# EAGLE design CONTROL circuit for Junction Box v2 (EAGLE 9.6.2)
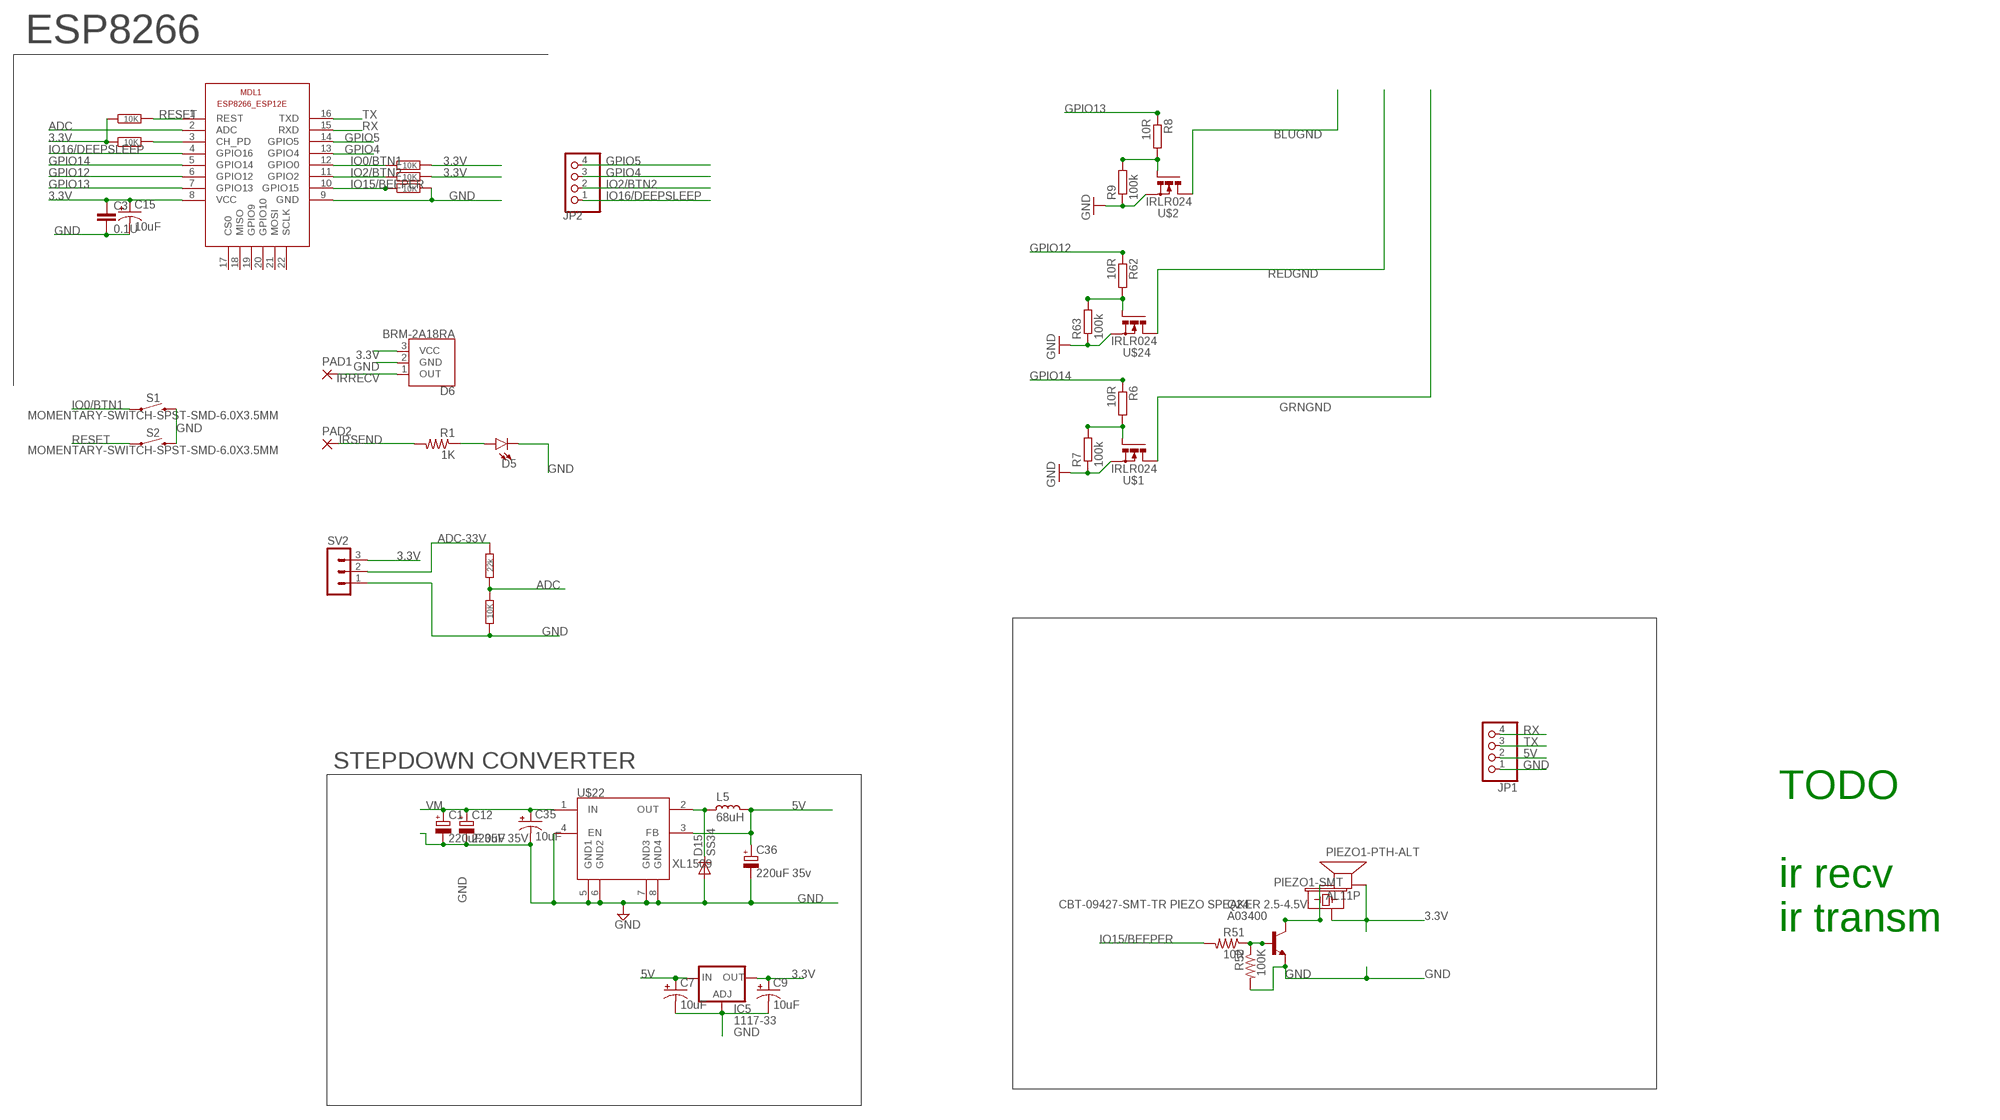
[diagram p0: schematic, sheet 1]

## Parts
C1  220uF 35V  CPOL-EUE3.5-8  [E3,5-8]
C3  0.1U  C-EUC1206  [C1206]
C7  10uF  CAP_POL1206  [EIA3216]
C9  10uF  CAP_POL1206  [EIA3216]
C12  220uF 35V  CPOL-EUE3.5-8  [E3,5-8]
C15  10uF  CAP_POL1206  [EIA3216]
C35  10uF  CAP_POL1206  [EIA3216]
C36  220uF 35v  CPOL-EUE3.5-8  [E3,5-8]
D5  LED3MM  [LED_3MM]
D6  BRM-2A18RA  [BRM-2508]
D15  SS34  DIODE-DO-214AC  [DO-214AC]
IC5  1117-33  LD117AS33TR  [SOT223]
JP1  PINHD-1X4  [1X04]
JP2  PINHD-1X4  [1X04]
L5  68uH  L_CD75  [CD75]
MDL1  ESP8266-12EESP8266-ESP12E  [ESP8266-ESP12E]
PAD1  1,6/0,9  [1,6/0,9]
PAD2  1,6/0,9  [1,6/0,9]
PIEZO1-PTH-ALT  AL11P  SPEAKER/AL11P  [AL11P]
PIEZO1-SMT  CBT-09427-SMT-TR PIEZO SPEAKER 2.5-4.5V  BUZZER-SMD  [BUZZER-CCV]
Q24  A03400  BC849SMD  [SOT23-BEC]
R1  1K  R-US_M1206  [M1206]
R3  22k  R-EU_R1206  [R1206]
R4  10K  R-EU_R1206  [R1206]
R6  10R  R-EU_R1206  [R1206]
R7  100k  R-EU_R1206  [R1206]
R8  10R  R-EU_R1206  [R1206]
R9  100k  R-EU_R1206  [R1206]
R11  10K  R-EU_R1206  [R1206]
R12  10K  R-EU_R1206  [R1206]
R28  10K  R-EU_R1206  [R1206]
R29  10K  R-EU_R1206  [R1206]
R31  10K  R-EU_R1206  [R1206]
R51  10R  R-US_R1206  [R1206]
R52  100K  R-US_R1206  [R1206]
R62  10R  R-EU_R1206  [R1206]
R63  100k  R-EU_R1206  [R1206]
S1  MOMENTARY-SWITCH-SPST-SMD-6.0X3.5MM  [TACTILE_SWITCH_SMD_6.0X3.5MM]
S2  MOMENTARY-SWITCH-SPST-SMD-6.0X3.5MM  [TACTILE_SWITCH_SMD_6.0X3.5MM]
SV2  MA03-1  [MA03-1]
U$1  IRLR024  N-POWER-MOSFETDPAK-MOSFET  [D-PAK_TO252AA]
U$2  IRLR024  N-POWER-MOSFETDPAK-MOSFET  [D-PAK_TO252AA]
U$22  XL1509  [SO08]
U$24  IRLR024  N-POWER-MOSFETDPAK-MOSFET  [D-PAK_TO252AA]

## Nets
3.3V: C3.1 C9.A(+) C15.A(+) D6.3(VCC) IC5.4(OUT) MDL1.8(VCC) PIEZO1-PTH-ALT.- PIEZO1-SMT.+ R11.2 R12.2 R28.1 R29.1 SV2.3
5V: C7.A(+) C36.+ IC5.3(IN) JP1.2 L5.1 U$22.3(FB)
ADC: MDL1.2(ADC) R3.1 R4.2
ADC-33V: R3.2 SV2.2
BEEPER-GND: PIEZO1-PTH-ALT.+ PIEZO1-SMT.- Q24.C
BLUGND: U$2.4(D)
GND: C1.- C3.2 C7.C(-) C9.C(-) C12.- C15.C(-) C35.C(-) C36.- D5.K(C) D6.2(GND) D15.2(A) IC5.1(ADJ) JP1.1 MDL1.9(GND) Q24.E R4.1 R7.1 R9.1 R31.2 R52.2 R63.1 S1.2 S2.2 SV2.1 U$1.3(S) U$2.3(S) U$22.4(EN) U$22.5(GND1) U$22.6(GND2) U$22.7(GND3) U$22.8(GND4) U$24.3(S)
GPIO4: JP2.3 MDL1.13(GPIO4)
GPIO5: JP2.4 MDL1.14(GPIO5)
GPIO12: MDL1.6(GPIO12) R62.1
GPIO13: MDL1.7(GPIO13) R8.1
GPIO14: MDL1.5(GPIO14) R6.1
GRNGND: U$1.4(D)
IO0/BTN1: MDL1.12(GPIO0) R12.1 S1.1
IO2/BTN2: JP2.2 MDL1.11(GPIO2) R11.1
IO15/BEEPER: MDL1.10(GPIO15) R31.1 R51.2
IO16/DEEPSLEEP: JP2.1 MDL1.4(GPIO16)
IRRECV: D6.1(OUT) PAD1.1(P)
IRSEND: PAD2.1(P) R1.2
N$3: R62.2 R63.2 U$24.1(G)
N$4: D15.1(C) L5.2 U$22.2(OUT)
N$5: R6.2 R7.2 U$1.1(G)
N$7: R8.2 R9.2 U$2.1(G)
N$13: D5.A R1.1
N$18: MDL1.3(CH_PD) R28.2
N$66: Q24.B R51.1 R52.1
REDGND: U$24.4(D)
RESET: MDL1.1(REST) R29.2 S2.1
RX: JP1.4 MDL1.15(RXD)
TX: JP1.3 MDL1.16(TXD)
VM: C1.+ C12.+ C35.A(+) U$22.1(IN)
Unconnected: MDL1.17(CS0) MDL1.18(MISO) MDL1.19(GPIO9) MDL1.20(GPIO10) MDL1.21(MOSI) MDL1.22(SCLK)

## Notes on the sheet
- ESP8266
- STEPDOWN CONVERTER
- TODO
  
  ir recv
  ir transm

## Library data of the parts
C1 C12 C36 = rcl:CPOL-EU: POLARIZED CAPACITOR, European symbol
C3 = rcl:C-EU: CAPACITOR, European symbol
C7 C9 C15 C35 = SparkFun:CAP_POL: Capacitor Polarized These are standard SMD and PTH capacitors. Normally 10uF, 47uF, and 100uF in electrolytic and tantalum varieties. Always verify the external diameter of the through hole cap, it varies with capacity, voltage, and manufacturer. The EIA devices should be standard.
D5 = SparkFun-LED:LED: LED (Generic) Standard schematic elements and footprints for 5mm, 3mm, 1206, and 0603 sized LEDs. Generic LEDs with no color specified.; PROD_ID: DIO-08794
D6 = SparkFun-Sensors:BRM-2A18: BRM-2A18 IR Receiver The BRM-2A18 is miniaturized infrared receiver for remote control and other applications requiring improved ambient light rejection. Vertical package is a primary component on the ZX Distance and Gesture Sensor. RA package is not currently in-use. Example Datasheet <http://www.sinoskysun.com/upload/20110512/201105120447164615.PDF> SparkFun Products ZX Distance and Gesture Sensor <https://www.sparkfun.com/products/12780> (COM-12780)
D15 = dp_devices:DIODE: Various Diode Packages
IC5 = v-reg:LD117A?*: Low drop fixed and adjustable positive voltage regulators 1 A Source: http://www.st.com/stonline/products/literature/ds/7194/ld1117axx.pdf
JP1 JP2 = pinhead:PINHD-1X4: PIN HEADER
L5 = rc-master-smd:L_: INDUCTOR
MDL1 = ESP8266-ESP12E:ESP8266-12E: ESP8266-12E with additional I/O and GPIO04/05 corrected The author cannot warrant that this library is free from error or will meet your specific requirements. Created by PuceBaboon.com. Komagane, Nagano, JAPAN
PAD1 PAD2 = wirepad:1,6/0,9: THROUGH-HOLE PAD
PIEZO1-PTH-ALT = adafruit:SPEAKER: SPEAKER Source: Buerklin Added PS12 (for part # PS1240 piezo) http://www.ladyada.net/library/pcb/eaglelibrary.html
PIEZO1-SMT = SparkFun-Electromechanical:BUZZER: Buzzer Small round buzzers that operate around the audible 2kHz range. You can use these as speakers to create simple music or user interfaces. Variant Overview: PTH - Mini Speaker - PC Mount 12mm 2.048kHz <https://www.sparkfun.com/products/7950> PTH_KIT - Mini Speaker - PC Mount 12mm 2.048kHz <https://www.sparkfun.com/products/7950> KIT simplifies soldering by adding stop mask to one side of the pads. PTH_NO_SILK - Mini Speaker - PC Mount 12mm 2.048kHz <https://www.sparkfun.com/products/7950> No silkscreen indicator of buzzer outline. PTH_KIT_NO_SILK - Mini Speaker - PC Mount 12mm 2.048kHz <https://www.sparkfun.com/products/7950> KIT package w/o silkscreen SMD - Buzzer Audio Magnetic (CCV-084B16) SMD buzzer used on, e.g. the LilyPad Buzzer <https://www.sparkfun.com/products/8463> and RFID USB Reader <https://www.sparkfun.com/products/9963>. SMD_KIT - Buzzer Audio Magnetic (CCV-084B16) SMD Buzzer with elongated pins to make soldering easier. Used on the SparkFun Simon Says - Surface Mount Soldering Kit <https://www.sparkfun.com/products/10935>.; PROD_ID: COMP-08568
Q24 = transistor-npn:BC849*: NPN Transistor
R1 R51 R52 = adafruit:R-US_: RESISTOR, American symbol
R3 R4 R11 R12 R28 R29 R31 = rcl:R-EU_: RESISTOR, European symbol
R6-R9 R62 R63 = resistor:R-EU_: RESISTOR, European symbol
S1 S2 = SparkFun-Switches:MOMENTARY-SWITCH-SPST: Momentary Switch (Pushbutton) - SPST Normally-open (NO) SPST momentary switches (buttons, pushbuttons). Variants PTH-12MM - 12mm square, through-hole Momentary Pushbutton Switch - 12mm Square <https://www.sparkfun.com/products/9190> (COM-09190) PTH-6.0MM, PTH-6.0MM-KIT - 6.0mm square, through-hole Mini Pushbutton Switch <https://www.sparkfun.com/products/97> (COM-00097) KIT package intended for soldering kit's - only one side of pads' copper is exposed. PTH-RIGHT-ANGLE-KIT - Right-angle, through-hole Right Angle Tactile Button <https://www.sparkfun.com/products/10791> - Used on SparkFun BigTime Watch Kit <https://www.sparkfun.com/products/11734> SMD-12MM - 12mm square, surface-mount Tactile Button - SMD (12mm) <https://www.sparkfun.com/products/12993> (COM-12993) Used on SparkFun PicoBoard <https://www.sparkfun.com/products/11888> SMD-4.5MM - 4.5mm Square Trackball Switch Used on SparkFun Blackberry Trackballer Breakout <https://www.sparkfun.com/products/13169> SMD-4.6MMX2.8MM - 4.60mm x 2.80mm, surface mount Used on SparkFun SAMD21 Mini Breakout <https://www.sparkfun.com/products/13664> SMD-5.2MM, SMD-5.2-REDUNDANT - 5.2mm square, surface-mount Mini Pushbutton Switch - SMD <https://www.sparkfun.com/products/8720> (COM-08720) Used on Arduino Pro Mini <https://www.sparkfun.com/products/11114> REDUNDANT package connects both switch circuits together SMD-6.0X3.5MM - 6.0 x 3.5mm, surface mount Momentary Reset Switch SMD <https://www.sparkfun.com/products/8229> (COM-08229) SMD-6.2MM-TALL - 6.2mm square, surface mount Tactile Button - SMD (6mm) <https://www.sparkfun.com/products/12992> Used on SparkFun Digital Sandbox <https://www.sparkfun.com/products/12651> SMD-RIGHT-ANGLE - Right-angle, surface mount Used on SparkFun Block for Intel® Edison - Arduino <https://www.sparkfun.com/products/13036>; PROD_ID: SWCH-00815; SF_SKU: COM-08229
SV2 = con-lstb:MA03-1: PIN HEADER; OC_FARNELL: unknown; OC_NEWARK: unknown
U$1 U$2 U$24 = Cohesion_parts:N-POWER-MOSFET
U$22 = Cohesion_parts:XL1509

## Board
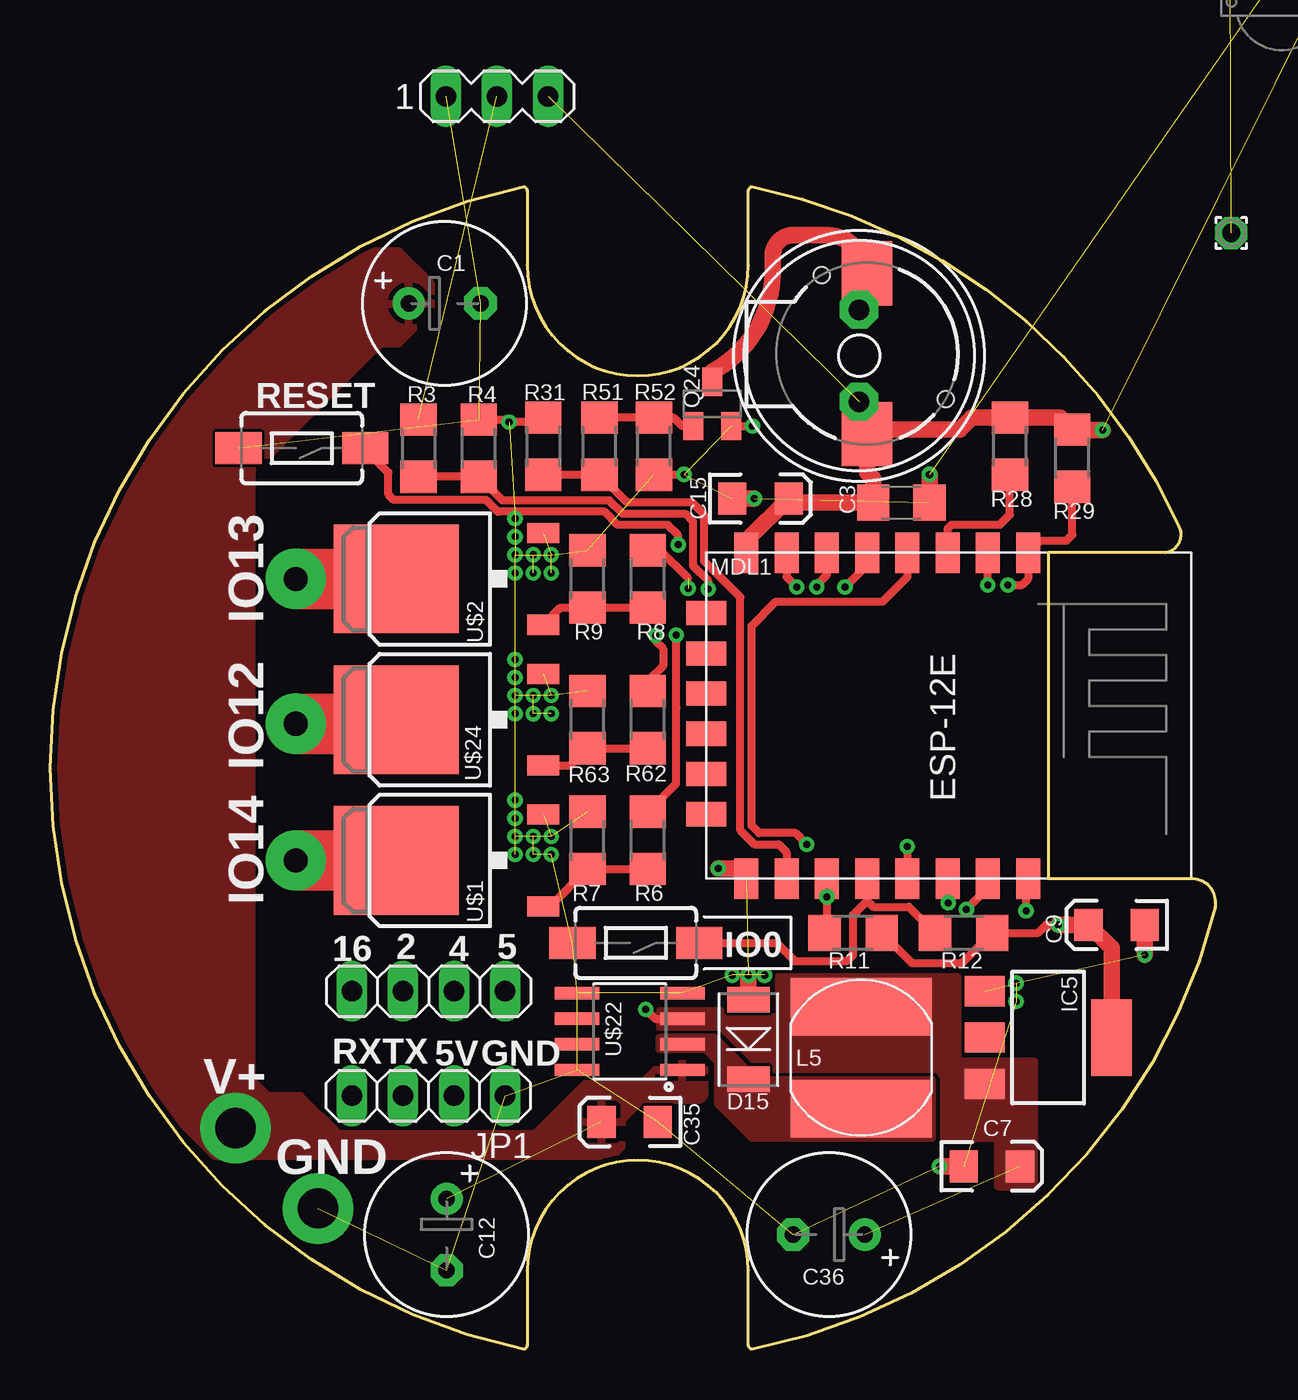
[diagram p1: board, top side]
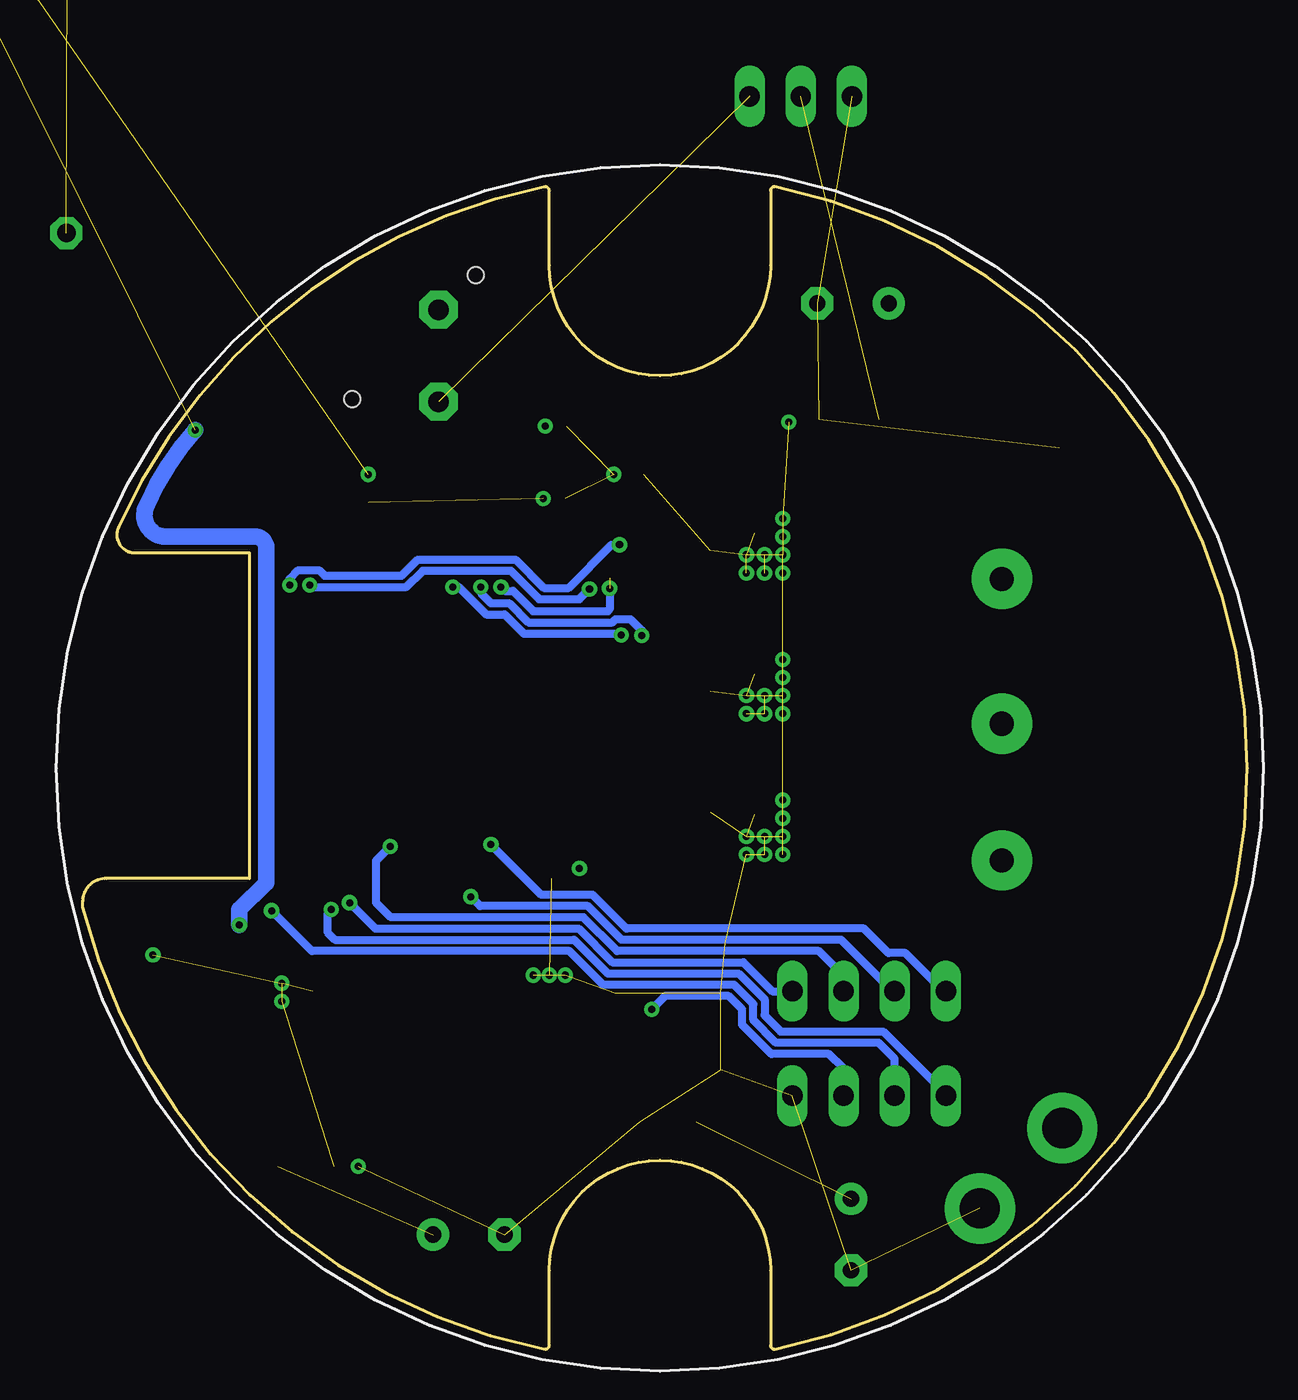
[diagram p2: board, bottom side, seen from below]

Size 57.9 x 57.8 mm. Coordinates in mm from the lower left corner, seen from the top.
Outline: 23.7,53.9 arc180 34.7,53.9 34.7,57.6 arc-90 34.9,57.8 arc-54 56.1,40.9 arc-109 55.4,39.6 49.6,39.6 49.6,23.4 56.7,23.4 arc-95 57.9,22.2 57.9,22 arc-65 34.9,0 arc-90 34.7,0.2 34.7,3.9 arc180 23.7,3.9 23.7,0.2 arc-90 23.5,0 arc-156 23.5,57.8 arc-90 23.7,57.6 23.7,53.9
Copper layers (1*16): Top 0.035mm / dielectric 1.5mm / Bottom 0.035mm
Design rules "default *": minimum track width 6mil, minimum drill 0.35mm, track to track 6mil, track to pad 6mil, pad to pad 6mil, via to via 6mil, smd to smd 6mil, copper to edge 10mil, drill to drill 6mil, minimum pad ring 10mil, minimum via ring 8mil, stop-mask expansion 4mil, vias tented up to drill 0mil, thermal gap 10mil

### Footprints (pad centres in the part's own frame; a part is rotated, then mirrored left to right if it is on the bottom)
E3,5-8 = drill 0.813 pad 1.6: + -1.778,0 | drill 0.813 pad 1.6 octagon: - 1.778,0
C1206 = smd 1.6 x 1.8: 1 -1.4,0; 2 1.4,0
EIA3216 = smd 1.4 x 1.6: A 1.4,0; C -1.4,0
LED_3MM = drill 0.813 pad 1.88: A -1.27,0; K 1.27,0
BRM-2508 = drill 1.016 pad 1.88: 1 -2.54,0; 2 0,0; 3 2.54,0
DO-214AC = smd 1.27 x 2.1: 1 -1.98,0; 2 1.98,0
SOT223 = smd 1.5 x 2: 1 -2.3,-3.15; 2 0,-3.15; 3 2.3,-3.15 | smd 3.8 x 2: 4 0,3.15
1X04 = drill 1.016 long: 1 -3.81,0; 2 -1.27,0; 3 1.27,0; 4 3.81,0
CD75 = smd 7 x 2.85: 1 0,2.54; 2 0,-2.54
ESP8266-ESP12E = smd 2 x 1.2: 1 0,16; 2 0,14; 3 0,12; 4 0,10; 5 0,8; 6 0,6; 7 0,4; 8 0,2; 9 16.2,2; 10 16.2,4; 11 16.2,6; 12 16.2,8; 13 16.2,10; 14 16.2,12; 15 16.2,14; 16 16.2,16 | smd 1.2 x 2: 17 11,0; 18 3,0; 19 5,0; 20 13,0; 21 7,0; 22 9,0
1,6/0,9 = drill 0.914 pad 1.6 octagon: 1 0,0
AL11P = drill 1.016 pad 1.905 octagon: + 2.286,0; - -2.286,0
BUZZER-CCV = smd 3.2 x 2.5: + 4,0; - -4,0 | hole 0.8: -3.9,-2.25; 2.25,3.9
SOT23-BEC = smd 1 x 1.4: B -0.95,-1.1; C 0,1.1; E 0.95,-1.1
M1206 = smd 1.6 x 2: 1 -1.4,0; 2 1.4,0
R1206 = smd 1.6 x 1.803: 1 -1.422,0; 2 1.422,0
TACTILE_SWITCH_SMD_6.0X3.5MM = smd 2.3 x 1.6: 1 -3.15,0; 2 3.15,0
MA03-1 = drill 1.016 long: 1 -2.54,0; 2 0,0; 3 2.54,0
D-PAK_TO252AA = smd 1 x 1.6: 1 -2.28,-4.8; 3 2.28,-4.8 | smd 5.4 x 6.2: 4 0,2.5
SO08 = smd 0.61 x 2.21: 1 -1.905,-2.616; 2 -0.635,-2.616; 3 0.635,-2.616; 4 1.905,-2.616; 5 1.905,2.616; 6 0.635,2.616; 7 -0.635,2.616; 8 -1.905,2.616

### Placement (x,y rotation side)
C1  19.6,52 0 top
C3  42.3,42.1 0 top
C7  46.8,9.1 0 top
C9  53,21.1 180 top
C12  19.7,5.7 270 top
C15  35.3,42.3 0 top
C35  28.8,11.3 180 top
C36  38.7,5.7 180 top
D5  71.9,63.2 180 bottom  (outside the outline)
D6  61.2,68.7 0 top  (outside the outline)
D15  34.7,15.4 90 top
IC5  49.6,15.5 270 top
JP1  18.8,12.6 180 top
JP2  18.8,17.8 0 top
L5  40.3,14.5 0 top
MDL1  32.6,39.6 270 top
PAD1  58.7,55.5 0 top
PAD2  69.4,69.4 0 top  (outside the outline)
PIEZO1-PTH-ALT  40.2,49.4 90 top
PIEZO1-SMT  40.6,49.5 270 top
Q24  32.9,47 0 top
R1  72,68.7 90 top  (outside the outline)
R3  18.3,44.8 90 top
R4  21.3,44.8 270 top
R6  29.7,25.3 270 top
R7  26.7,25.3 270 top
R8  29.7,38.3 270 top
R9  26.7,38.3 270 top
R11  39.9,20.7 0 top
R12  45.4,20.7 0 top
R28  47.7,44.9 270 top
R29  50.8,44.3 270 top
R31  24.5,44.9 90 top
R51  27.3,44.9 270 top
R52  30,44.9 270 top
R62  29.7,31.3 270 top
R63  26.7,31.3 270 top
S1  29.1,20.2 180 top
S2  12.5,44.8 180 top
SV2  22.2,62.3 0 top  (outside the outline)
U$1  19.7,24.3 90 top
U$2  19.7,38.3 90 top
U$22  28.8,15.8 90 top
U$24  19.7,31.3 90 top

### Tracks (layer width: path | path; a pad name or v marks a point on that pad's centre or on a via)
3.3V  (via drill 0.35)  (2 unrouted)
  Top 0.406: R11.2 42.82,19.2 45.32,19.2 R12.2 49.1,20.7 49.5,21.1 v50.1,21.1 | MDL1.8 34.6,40
  Top 0.813: v50.1,21.1 C9.A 52.75,19.95 IC5.4 | v52.3,45.7 50.82,45.7 R29.1 50.2,46.32 R28.1 45.8,46.32 45.2,45.72 40.82,45.72 PIEZO1-SMT.+ | PIEZO1-SMT.+ 40.6,43.6 40.9,43.3 C3.1 36.9,42.1 C15.A 34.6,40.2 MDL1.8 | PIEZO1-SMT.+ 40.6,46.71 PIEZO1-PTH-ALT.-
  Bottom 0.813: v50.1,21.1 50.1,21.86 48.76,23.2 48.76,39.86 arc-85 49.3,40.4 53.66,40.4 arc124 54.69,41.99 arc18 52.31,45.69 v52.3,45.7
5V  (via drill 0.35)  (1 unrouted)
  Top 0.406: v29.6,16.9 30.07,16.43 U$22.3
  Bottom 0.406: JP1.2 20.07,13.95 20.8,14.68 23.66,14.68 25.12,16.14 25.12,16.9 25.78,17.56 28.94,17.56 v29.6,16.9
  pour Top (rank 2, no thermals): 30.3,16 33.2,16 35.3,13.9 44.1,13.9 44.4,13.6 44.4,10.5 47.1,10.5 47.1,8.1 48.9,8.1 48.9,14.3 45.2,14.3 45.1,14.4 45.1,18.5 36.2,18.5 36.2,16.5 33.6,16.5 33.3,16.8 30.3,16.8
ADC  (via drill 0.35)
  Top 0.406: v32.7,37.8 32.7,38.21 31.94,38.97 31.94,41.16 31.56,41.54 28.45,41.54 27.79,42.2 22.48,42.2 R4.2 18.82,43.38 18.8,43.4 18.32,43.4 R3.1 | v46.6,38 MDL1.2
  Bottom 0.406: v32.7,37.8 33.2,37.3 35.2,37.3 36.6,38.7 41,38.7 41.8,37.9 46.5,37.9 v46.6,38
ADC-33V  (1 unrouted)
BEEPER-GND
  Top 0.813: Q24.C 32.9,48.6 arc60 35.9,53.4 35.9,54.4 arc-87 36.9,55.4 38.7,55.4 arc-83 PIEZO1-SMT.- 40.6,52.09 PIEZO1-PTH-ALT.+
BLUGND  (via drill 1.2 pad 3)
  Top 3: U$2.4 v12.2,38.3
GND  (via drill 0.35, 2 pad 3.5)  (59 unrouted)
  Top 0.406: R52.2 31.48,43.48 v31.5,43.5 | Q24.E v34.9,45.9 | R4.1 22.68,46.22 v22.8,46.1 24.28,46.1 R31.2
  Top 0.813: C9.C v54.4,19.6 | C3.2 v43.7,43.5 | C15.C v35,42.3 | C7.C v44.2,9.1 | MDL1.9 34.1,23.9 v33.2,23.9 | D15.2 v34.7,18.6
  other vias: 24,39.5 24.9,39.5 23.1,39.5 23.1,40.4 23.1,41.3 23.1,33.4 23.1,32.5 24,32.5 24.9,32.5 23.1,34.3 23.1,26.4 23.1,25.5 24,25.5 24.9,25.5 23.1,27.3 24.9,38.6 24,38.6 23.1,38.6 24.9,31.6 24,31.6 23.1,31.6 24.9,24.6 24,24.6 23.1,24.6 48,18.2 48,17.3 35.5,18.6 33.9,18.6 13.3,7
GPIO4  (via drill 0.35)
  Top 0.406: v42.6,25 MDL1.13
  Bottom 0.406: JP2.3 20.07,18.57 21.3,19.8 31.33,19.8 33.01,21.48 42.58,21.48 43.3,22.2 43.3,24.3 v42.6,25
GPIO5  (via drill 0.35)
  Top 0.406: v44.63,22.2 44.63,23.37 MDL1.14
  Bottom 0.406: v44.63,22.2 43.34,20.92 33.24,20.92 31.56,19.24 25.05,19.24 23.61,17.8 JP2.4
GPIO12  (via drill 0.35)
  Top 0.406: MDL1.6 38.6,38.5 38.1,38 v38.1,37.9 | R62.1 29.7,33.22 30.46,33.98 30.46,34.83 30.1,35.19 v30.1,35.49
  Bottom 0.406: v38.1,37.9 38.1,37.6 37.6,37.1 36.69,37.1 35.73,36.14 31.56,36.14 31.4,36.3 30.66,36.3 30.1,35.74 v30.1,35.49
GPIO13  (via drill 0.35)  (1 unrouted)
  Top 0.406: MDL1.7 36.6,38.4 v37.1,37.9 | R8.1 30.31,39.72 31.7,38.33
  Bottom 0.406: v37.1,37.9 36.9,37.7 36.5,37.7 35.5,36.7 31.79,36.7 31.7,36.79 v31.7,37.83
GPIO14  (via drill 0.35)
  Top 0.406: MDL1.5 40.6,39 v39.5,37.9 | R6.1 31.1,28.12 31.1,31.88 31.12,31.9 v31.12,35.51 v31.12,35.52
  Bottom 0.406: v39.5,37.9 39.2,37.9 37.84,36.54 36.92,36.54 35.96,35.58 31.18,35.58 v31.12,35.52
GRNGND  (via drill 1.2 pad 3)
  Top 3: U$1.4 v12.2,24.3
IO0/BTN1
  Top 0.406: 40.6,22.3 MDL1.12 | 40.6,22.3 40.9,22 42.68,22 R12.1 | S1.1 36.1,20.2 37,19.3 39.6,19.3 39.9,19.6 39.9,21.6 40.6,22.3
IO2/BTN2  (via drill 0.35)
  Top 0.406: MDL1.11 v38.6,22.5 38.6,20.82 R11.1
  Bottom 0.406: JP2.2 17.63,17.8 20.19,20.36 31.1,20.36 32.77,22.03 38.14,22.03 v38.6,22.5
IO15/BEEPER
  Top 0.406: MDL1.10 36.6,24.7 36.2,25.1 35,25.1 34.3,25.8 34.3,37.4 32.5,39.2 32.5,41.5 31.9,42.1 28.68,42.1 R51.2 R31.1
IO16/DEEPSLEEP  (via drill 0.35)
  Top 0.406: MDL1.4 42.6,38.4 41.37,37.17 36.07,37.17 34.86,35.96 34.86,26.03 35.23,25.66 37.04,25.66 v37.6,25.1
  Bottom 0.406: JP2.1 15.1,17.8 17,19.7 17.84,19.7 19.06,20.92 30.87,20.92 32.54,22.59 35.09,22.59 v37.6,25.1
IRRECV  (1 unrouted)
IRSEND  (1 unrouted)
N$3
  Top 0.406: U$24.1 25.84,29.02 R63.2 R62.2
N$4
  pour Top (no thermals): 30.3,15.5 33,15.5 33.7,14.8 35.1,13.4 40.3,13.4 43.8,13.4 43.8,10.5 34.9,10.5 33.8,11.6 33.2,12.2 33.2,13.8 33.2,14.3 32.6,14.9 30.3,14.9
N$5
  Top 0.406: U$1.1 24.84,22.02 R7.2 R6.2
N$7
  Top 0.406: U$2.1 25.36,36.88 R9.2 29.02,36.88 29.1,36.8 29.62,36.8 R8.2
N$13  (1 unrouted)
N$18
  Top 0.406: 44.6,39.9 MDL1.3 44.6,40.8 44.8,41 47.2,41 47.7,41.5 R28.2
N$66
  Top 0.406: Q24.B 31.4,45.9 30.98,46.32 R52.1 R51.1
REDGND  (via drill 1.2 pad 3)
  Top 3: U$24.4 17,31.1 v12.2,31.1
RESET  (via drill 0.35)
  Top 0.406: R29.2 50.8,40.5 50.5,40.2 49.2,40.2 MDL1.1 48.6,38.3 48.3,38 v47.6,38 | v31.21,40 31.21,40.47 30.7,40.98 28.22,40.98 27.56,41.64 22.25,41.64 21.67,42.22 17.08,42.22 16.8,42.5 16.8,43.6 15.65,44.75 S2.1
  Bottom 0.406: v47.6,38 47.6,38.3 47.17,38.73 46.13,38.73 45.86,38.46 42.03,38.46 41.23,39.26 36.37,39.26 34.97,37.86 33.74,37.86 31.6,40 v31.21,40
RX  (via drill 0.35)
  Top 0.406: v45.54,21.86 46.6,22.93 MDL1.15
  Bottom 0.406: v45.54,21.86 45.7,21.7 45.7,20.7 45.36,20.36 33.47,20.36 31.79,18.68 25.28,18.68 24,17.4 24,16.6 23.2,15.8 18.1,15.8 14.99,12.69 JP1.4
TX  (via drill 0.35)
  Top 0.406: v48.5,21.8 48.5,23.3 MDL1.16
  Bottom 0.406: v48.5,21.8 46.5,19.8 33.7,19.8 32.02,18.12 25.51,18.12 24.56,17.17 24.56,16.37 23.43,15.24 18.33,15.24 17.53,14.44 JP1.3
VM  (via drill 2 pad 3.5)  (1 unrouted)
  other vias: 9.2,11
  pour Top: 10.8,12.6 12.4,12.6 14.3,10.7 24.1,10.7 26.6,13.2 29.4,13.2 30.4,14.2 32.3,14.2 32.5,14 32.5,12.6 32.3,12.4 29.4,12.4 28.4,11.4 28.4,10.1 27.9,9.6 8.2,9.6 -0.3,18.1 -0.3,41.4 12.9,54.6 17.3,54.6 18.9,53 18.9,51.6 17.3,50 16.4,50 10,43.6 10,13.4

### Text on the board
tPlace: RESET | IO13 | IO12 | IO14 | IO0 | 16 | 2 | 4 | 5 | RX | TX | 5V | GND | V+ | GND